# EAGLE design BLE_LCD (EAGLE 9.2.1)
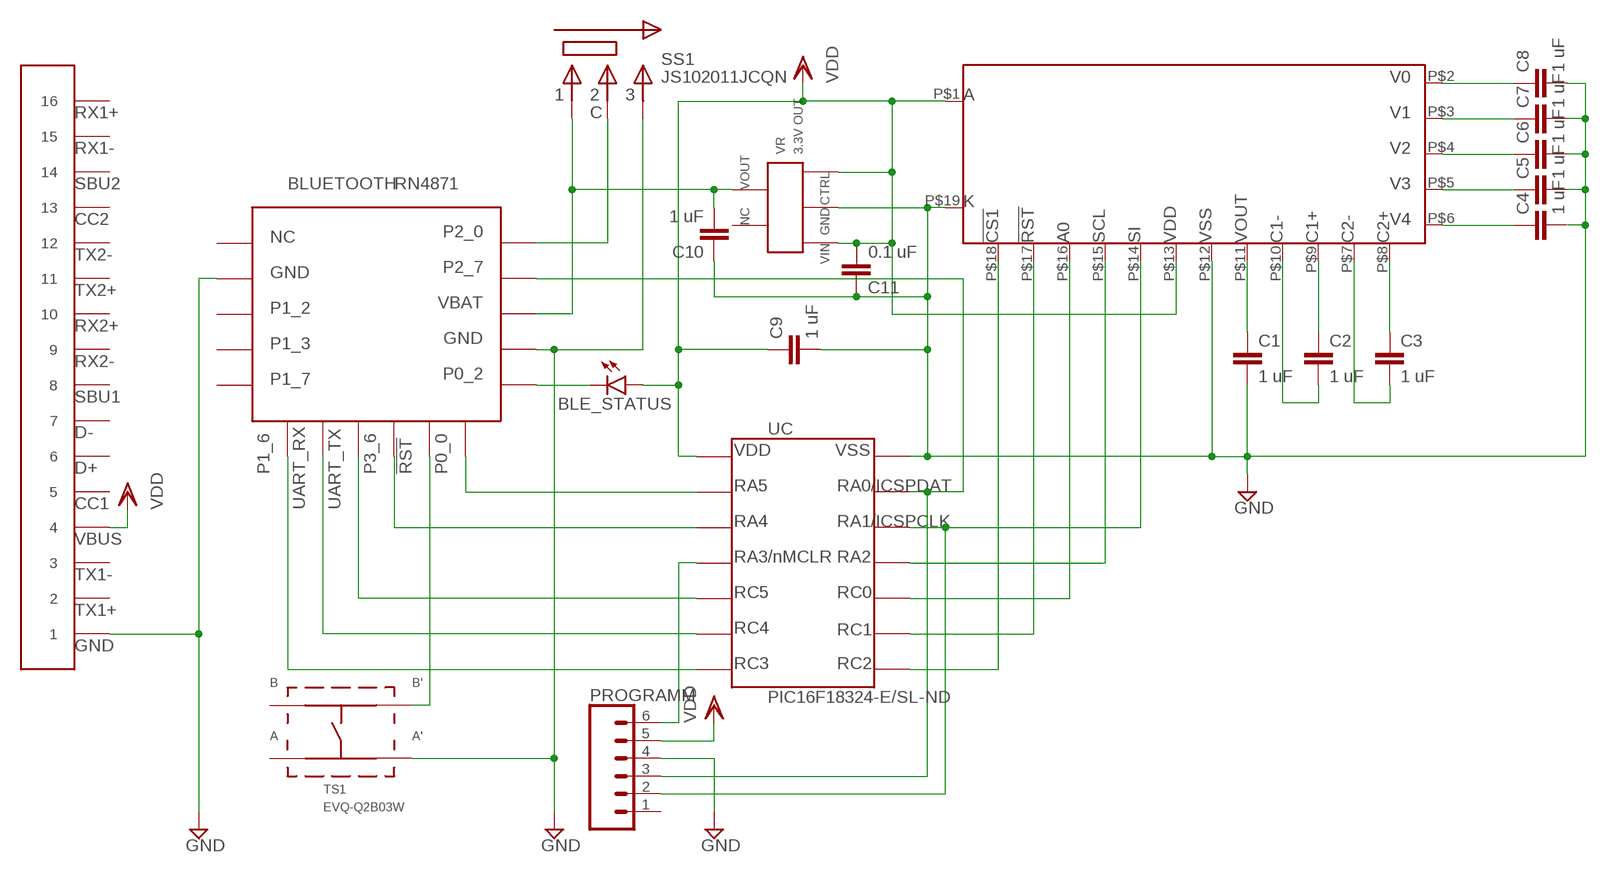
[diagram p0: schematic, sheet 1]

## Parts
5VPOWER  USB-C  [USB-C]
BLE_STATUS  LEDCHIPLED_1206  [CHIPLED_1206]
BLUETOOTH  RN4871  [RN4871]
C1  1 uF  C-EUC0805  [C0805]
C2  1 uF  C-EUC0805  [C0805]
C3  1 uF  C-EUC0805  [C0805]
C4  1 uF  C-EUC0805  [C0805]
C5  1 uF  C-EUC0805  [C0805]
C6  1 uF  C-EUC0805  [C0805]
C7  1 uF  C-EUC0805  [C0805]
C8  1 uF  C-EUC0805  [C0805]
C9  1 uF  C-EUC0805  [C0805]
C10  1 uF  C-EUC0805  [C0805]
C11  0.1 uF  C-EUC0805  [C0805]
LCD  NHD-C12832A1Z-NSW-BBW-3V3  [NHD-C12832A1Z-NSW-BBW-3V3]
PROGRAMM  CONN_06NO_SILK_FEMALE_PTH  [1X06_NO_SILK]
SS1  JS102011JCQN  [JS102011JCQN]
TS1  EVQ-Q2B03W  [EVQ-Q2B03W]
UC  PIC16F18324-E/SL-ND  [PIC16F18324-E/SL-ND]
VR  3.3V OUT  TCR2EF33LM  [TCR2EF33LM]

## Nets
GND: 5VPOWER.A1 5VPOWER.A12 5VPOWER.B1 5VPOWER.B12 BLUETOOTH.P$2 BLUETOOTH.P$13 C1.2 C4.2 C5.2 C6.2 C7.2 C8.2 C9.2 C10.1 C11.1 LCD.P$12 LCD.P$19 PROGRAMM.4 SS1.P$3 TS1.P$4 UC.P$14 VR.P$2
N$1: C4.1 LCD.P$6
N$2: C5.1 LCD.P$5
N$3: C6.1 LCD.P$4
N$4: C7.1 LCD.P$3
N$5: C8.1 LCD.P$2
N$6: C1.1 LCD.P$11
N$7: C2.1 LCD.P$9
N$8: C2.2 LCD.P$10
N$9: C3.1 LCD.P$8
N$10: C3.2 LCD.P$7
N$11: LCD.P$15 UC.P$11
N$12: LCD.P$16 UC.P$10
N$13: LCD.P$17 UC.P$9
N$14: LCD.P$18 UC.P$8
N$15: LCD.P$14 PROGRAMM.2 UC.P$12
N$16: BLUETOOTH.P$6 UC.P$7
N$17: BLUETOOTH.P$7 UC.P$6
N$18: PROGRAMM.6 UC.P$4
N$19: BLUETOOTH.P$14 C10.2 SS1.P$1 VR.P$5
N$20: BLUETOOTH.P$10 TS1.P$3
N$21: BLUETOOTH.P$8 UC.P$5
N$22: BLUETOOTH.P$9 UC.P$3
N$23: BLUETOOTH.P$11 UC.P$2
N$24: BLE_STATUS.C BLUETOOTH.P$12
N$25: BLUETOOTH.P$15 PROGRAMM.3 UC.P$13
N$26: BLUETOOTH.P$16 SS1.P$2
VDD: 5VPOWER.A4 5VPOWER.A9 5VPOWER.B4 5VPOWER.B9 BLE_STATUS.A C9.1 C11.2 LCD.P$1 LCD.P$13 PROGRAMM.5 UC.P$1 VR.P$1 VR.P$3
Unconnected: 5VPOWER.A2 5VPOWER.A3 5VPOWER.A5 5VPOWER.A6 5VPOWER.A7 5VPOWER.A8 5VPOWER.A10 5VPOWER.A11 5VPOWER.B2 5VPOWER.B3 5VPOWER.B5 5VPOWER.B6 5VPOWER.B7 5VPOWER.B8 5VPOWER.B10 5VPOWER.B11 BLUETOOTH.P$1 BLUETOOTH.P$3 BLUETOOTH.P$4 BLUETOOTH.P$5 PROGRAMM.1 TS1.P$1 TS1.P$2 VR.P$4

## Library data of the parts
5VPOWER = USB:USB-C
BLE_STATUS = led:LED: LED OSRAM: - CHIPLED LG R971, LG N971, LY N971, LG Q971, LY Q971, LO R971, LY R971 LH N974, LH R974 LS Q976, LO Q976, LY Q976 LO Q996 - Hyper CHIPLED LW Q18S LB Q993, LB Q99A, LB R99A - SideLED LS A670, LO A670, LY A670, LG A670, LP A670 LB A673, LV A673, LT A673, LW A673 LH A674 LY A675 LS A676, LA A676, LO A676, LY A676, LW A676 LS A679, LY A679, LG A679 - Hyper Micro SIDELED® LS Y876, LA Y876, LO Y876, LY Y876 LT Y87S - SmartLED LW L88C, LW L88S LB L89C, LB L89S, LG L890 LS L89K, LO L89K, LY L89K LS L896, LA L896, LO L896, LY L896 - TOPLED LS T670, LO T670, LY T670, LG T670, LP T670 LSG T670, LSP T670, LSY T670, LOP T670, LYG T670 LG T671, LOG T671, LSG T671 LB T673, LV T673, LT T673, LW T673 LH T674 LS T676, LA T676, LO T676, LY T676, LB T676, LH T676, LSB T676, LW T676 LB T67C, LV T67C, LT T67C, LS T67K, LO T67K, LY T67K, LW E67C LS E67B, LA E67B, LO E67B, LY E67B, LB E67C, LV E67C, LT E67C LW T67C LS T679, LY T679, LG T679 LS T770, LO T770, LY T770, LG T770, LP T770 LB T773, LV T773, LT T773, LW T773 LH T774 LS E675, LA E675, LY E675, LS T675 LS T776, LA T776, LO T776, LY T776, LB T776 LHGB T686 LT T68C, LB T68C - Hyper Mini TOPLED® LB M676 - Mini TOPLED Santana® LG M470 LS M47K, LO M47K, LY M47K Source: http://www.osram.convergy.de LUXEON: - LUMILED® LXK2-PW12-R00, LXK2-PW12-S00, LXK2-PW14-U00, LXK2-PW14-V00 LXK2-PM12-R00, LXK2-PM12-S00, LXK2-PM14-U00 LXK2-PE12-Q00, LXK2-PE12-R00, LXK2-PE12-S00, LXK2-PE14-T00, LXK2-PE14-U00 LXK2-PB12-K00, LXK2-PB12-L00, LXK2-PB12-M00, LXK2-PB14-N00, LXK2-PB14-P00, LXK2-PB14-Q00 LXK2-PR12-L00, LXK2-PR12-M00, LXK2-PR14-Q00, LXK2-PR14-R00 LXK2-PD12-Q00, LXK2-PD12-R00, LXK2-PD12-S00 LXK2-PH12-R00, LXK2-PH12-S00 LXK2-PL12-P00, LXK2-PL12-Q00, LXK2-PL12-R00 Source: www.luxeon.com KINGBRIGHT: KA-3528ASYC Source: www.kingbright.com
BLUETOOTH = Microchip_BLE:RN4871
C1-C11 = rcl:C-EU: CAPACITOR, European symbol; SPICEPREFIX: C
LCD = Newhaven_display:NHD-C12832A1Z-NSW-BBW-3V3
PROGRAMM = SparkFun-Connectors:CONN_06: Multi connection point. Often used as Generic Header-pin footprint for 0.1 inch spaced/style header connections On any of the 0.1 inch spaced packages, you can populate with these: Break Away Headers - Straight <https://www.sparkfun.com/products/116> (PRT-00116) Break Away Male Headers - Right Angle <https://www.sparkfun.com/products/553> (PRT-00553) Female Headers <https://www.sparkfun.com/products/115> (PRT-00115) Break Away Headers - Machine Pin <https://www.sparkfun.com/products/117> (PRT-00117) Break Away Female Headers - Swiss Machine Pin <https://www.sparkfun.com/products/743> (PRT-00743) Arduino Stackable Header - 6 Pin <https://www.sparkfun.com/products/9280> (PRT-09280) For SCREWTERMINALS and SPRING TERMINALS visit here: Screw Terimnals on SparkFun.com <https://www.sparkfun.com/search/results?term=Screw+Terminals> (5mm/3.5mm/2.54mm spacing) This device is also useful as a general connection point to wire up your design to another part of your project. Our various solder wires solder well into these plated through hole pads. Hook-Up Wire - Assortment (Stranded, 22 AWG) <https://www.sparkfun.com/products/11375> (PRT-11375) Hook-Up Wire - Assortment (Solid Core, 22 AWG) <https://www.sparkfun.com/products/11367> (PRT-11367) View the entire wire category on our website here <https://www.sparkfun.com/categories/141>; PROD_ID: CONN-08437
SS1 = C&K_slide_switch:JS102011JCQN
TS1 = Panasonic_tactile_switch:EVQ-Q2B03W
UC = Microchip_PIC:PIC16F18324-E/SL-ND
VR = Toshiba_voltage_regulator:TCR2EF33LM

## Board
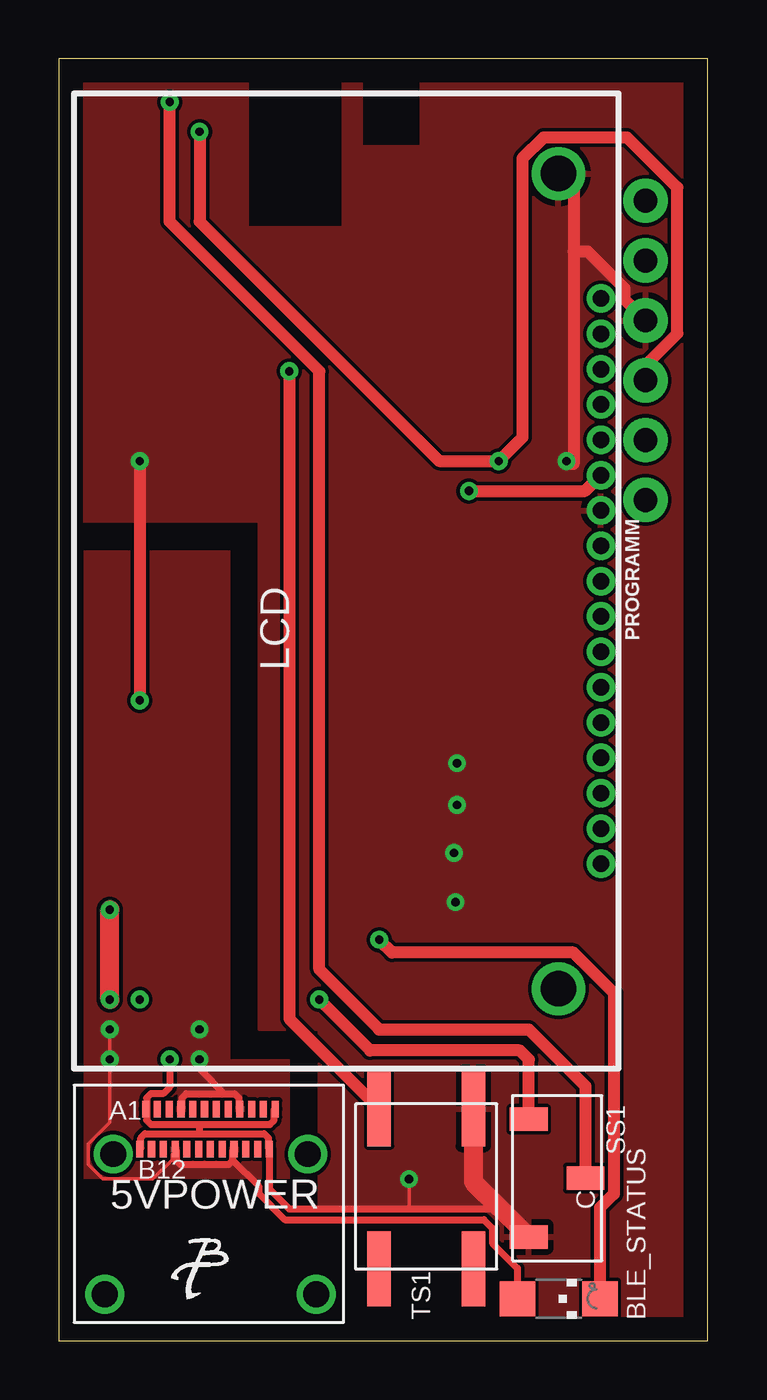
[diagram p1: board, top side]
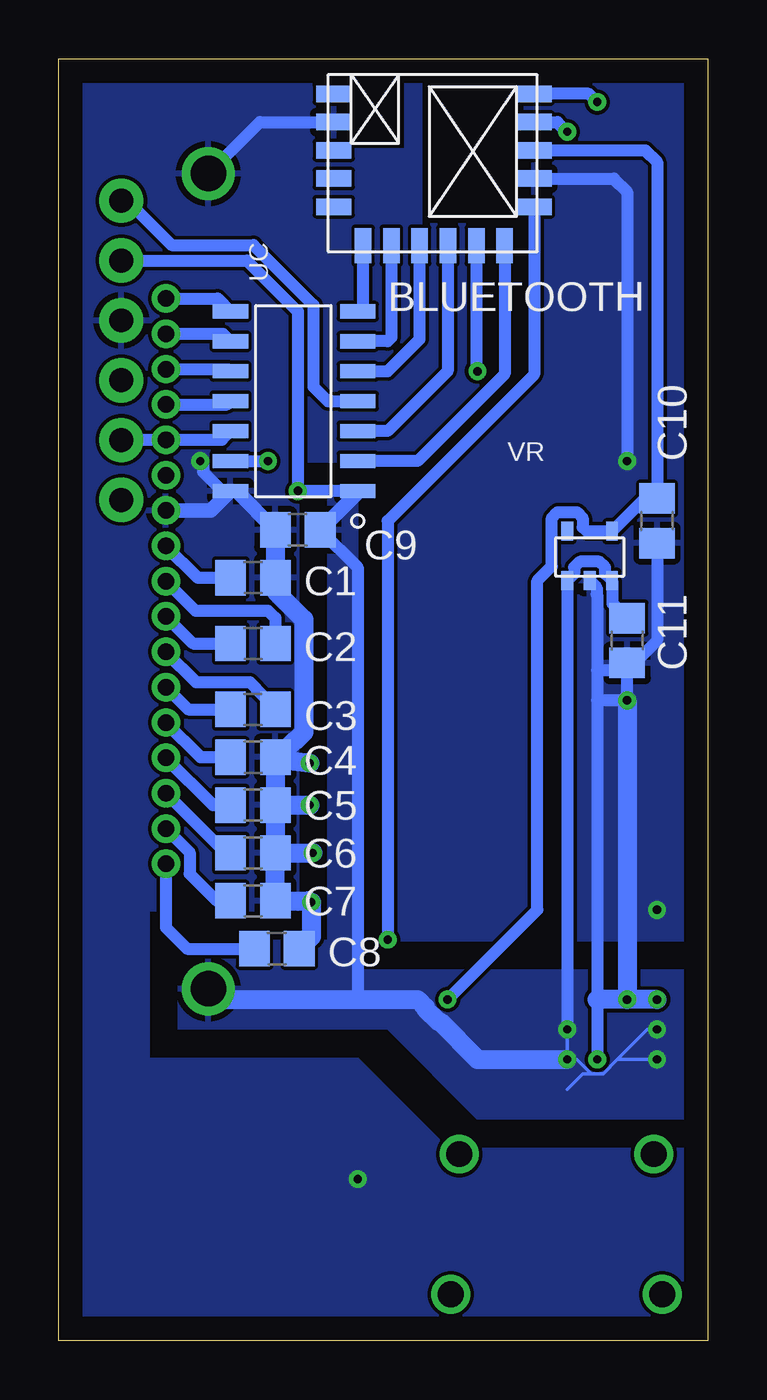
[diagram p2: board, bottom side, seen from below]

Size 27.54 x 54.41 mm. Coordinates in mm from the lower left corner, seen from the top.
Outline: 0,0 27.54,0 27.54,54.41 0,54.41 0,0
Copper layers (1*16): Top 0.035mm / dielectric 1.5mm / Bottom 0.035mm
Design rules "default": minimum track width 6mil, minimum drill 0.35mm, track to track 6mil, track to pad 6mil, pad to pad 6mil, via to via 6mil, smd to smd 6mil, copper to edge 40mil, drill to drill 6mil, minimum pad ring 10mil, minimum via ring 8mil, stop-mask expansion 4mil, vias tented up to drill 0mil, thermal gap 10mil

### Footprints (pad centres in the part's own frame; a part is rotated, then mirrored left to right if it is on the bottom)
USB-C = drill 1.1: 1 -1.13,-0.21; 2 7.13,-0.21; 3 -1.49,-6.16; 4 7.49,-6.16 | smd 0.3 x 0.7: A1 0.25,1.7; A2 0.75,1.7; A3 1.25,1.7; A4 1.75,1.7; A5 2.25,1.7; A6 2.75,1.7; A7 3.25,1.7; A8 3.75,1.7; A9 4.25,1.7; A10 4.75,1.7; A11 5.25,1.7; A12 5.75,1.7; B1 5.5,0; B2 5,0; B3 4.5,0; B4 4,0; B5 3.5,0; B6 3,0; B7 2.5,0; B8 2,0; B9 1.5,0; B10 1,0; B11 0.5,0; B12 0,0
CHIPLED_1206 = smd 1.5 x 1.5: A 0,-1.75; C 0,1.75
RN4871 = smd 1.5 x 0.7: P$1 0.25,6.7; P$2 0.25,5.5; P$3 0.25,4.3; P$4 0.25,3.1; P$5 0.25,1.9; P$12 8.75,1.9; P$13 8.75,3.1; P$14 8.75,4.3; P$15 8.75,5.5; P$16 8.75,6.7 | smd 0.7 x 1.5: P$6 1.5,0.25; P$7 2.7,0.25; P$8 3.9,0.25; P$9 5.1,0.25; P$10 6.3,0.25; P$11 7.5,0.25
C0805 = smd 1.3 x 1.5: 1 -0.95,0; 2 0.95,0
NHD-C12832A1Z-NSW-BBW-3V3 = drill 1.5: P$1 3,2.55; P$19 37.6,2.55 | drill 0.7: P$2 8.3,0.75; P$3 9.8,0.75; P$4 11.3,0.75; P$5 12.8,0.75; P$6 14.3,0.75; P$7 15.8,0.75; P$8 17.3,0.75; P$9 18.8,0.75; P$10 20.3,0.75; P$11 21.8,0.75; P$12 23.3,0.75; P$13 24.8,0.75; P$14 26.3,0.75; P$15 27.8,0.75; P$16 29.3,0.75; P$17 30.8,0.75; P$18 32.3,0.75
1X06_NO_SILK = drill 1.016 pad 1.88: 1 0,0; 2 2.54,0; 3 5.08,0; 4 7.62,0; 5 10.16,0; 6 12.7,0
JS102011JCQN = smd 1 x 1.6: P$1 0,0; P$2 2.5,2.4; P$3 5,0
EVQ-Q2B03W = smd 3.2 x 1: P$1 0,0; P$2 0,-4; P$3 6.8,0; P$4 6.8,-4
PIC16F18324-E/SL-ND = smd 0.6 x 1.5: P$1 0,0; P$2 1.27,0; P$3 2.54,0; P$4 3.81,0; P$5 5.08,0; P$6 6.35,0; P$7 7.62,0; P$8 7.62,5.4; P$9 6.35,5.4; P$10 5.08,5.4; P$11 3.81,5.4; P$12 2.54,5.4; P$13 1.27,5.4; P$14 0,5.4
TCR2EF33LM = smd 0.5 x 0.8: P$1 0,0; P$2 0.95,0; P$3 1.9,0; P$4 0,2.1; P$5 1.9,2.1

### Placement (x,y rotation side)
5VPOWER  3.43,8.13 0 top
BLE_STATUS  21.21,1.78 270 top
BLUETOOTH  16.13,46.23 0 bottom
C1  19.3,32.38 0 bottom
C2  19.3,29.59 0 bottom
C3  19.3,26.8 180 bottom
C4  19.3,24.77 0 bottom
C5  19.3,22.73 0 bottom
C6  19.3,20.7 0 bottom
C7  19.3,18.67 0 bottom
C8  18.29,16.64 0 bottom
C9  17.4,34.42 180 bottom
C10  2.16,34.8 90 bottom
C11  3.43,29.72 90 bottom
LCD  23.75,11.94 90 top
PROGRAMM  24.89,35.69 90 top
SS1  19.94,9.4 270 top
TS1  13.59,3.05 90 top
UC  14.86,36.07 90 bottom
VR  5.97,32.26 0 bottom

### Tracks (layer width: path | path; a pad name or v marks a point on that pad's centre or on a via)
GND  (via drill 0.35)
  Top 0.152: 14.86,5.59 v14.86,6.86
  Top 0.305: 5.97,8.78 3.65,8.78 3.47,8.6 3.47,8.17 5VPOWER.B12 | 5.97,8.78 8.71,8.78 8.88,8.6 8.88,8.17 5VPOWER.B1 8.93,6.44 9.78,5.59 14.86,5.59 18.67,5.59 18.71,5.63 | 5VPOWER.A1 3.72,9.78 | 3.72,9.78 3.72,9.35 3.9,9.17 5.97,9.17 | 5VPOWER.A12 9.13,9.78 9.13,9.35 8.96,9.17 5.97,9.17 | 5.97,8.78 5.97,9.17 | v4.7,11.94 4.7,10.76 4.42,10.48 3.9,10.48 3.72,10.3 3.72,9.78
  Top 0.508: LCD.P$19 21.84,48.89 21.84,46.23 | 21.84,46.23 21.84,37.21 21.67,37.21 v21.54,37.34 | v3.43,37.34 v3.43,27.18 | PROGRAMM.4 24.01,44.19 24.01,44.66 22.44,46.23 21.84,46.23
  Top 0.813: TS1.P$4 17.59,6.75 18.71,5.63 SS1.P$3 | v2.16,14.48 v2.16,18.29
  Bottom 0.508: LCD.P$19 19.01,51.73 BLUETOOTH.P$2 | VR.P$2 4.72,31.96 4.72,31.69 4.7,31.66 4.7,28.45 | 4.7,28.45 4.7,27.18 | 4.7,27.18 4.7,14.48 v4.7,11.94 | v21.54,37.34 21.41,37.21 21.41,36.87 20.61,36.07 UC.P$14 | C11.1 3.75,28.45 4.7,28.45 | C10.1 2.16,29.72 3.11,28.77 C11.1 | BLUETOOTH.P$13 3.99,49.33 3.43,48.77 v3.43,37.34 | 4.7,27.18 v3.43,27.18 C11.1
  Bottom 0.61: C9.2 20,36.07 UC.P$14 21.09,35.24 LCD.P$12
  Bottom 0.813: C9.2 C1.2 18.35,31.82 17.14,30.61 17.14,25.82 17.47,25.49 17.5,25.49 18.35,24.64 | 18.35,24.64 C4.2 18.29,24.7 v16.89,24.51 | 18.35,24.64 C5.2 | C5.2 C6.2 | C6.2 C7.2 16.97,18.67 v16.83,18.61 16.83,17.14 C8.2 | v2.16,14.48 v3.43,14.48 | v3.43,14.48 4.7,14.48 | C6.2 v16.76,20.7 | C5.2 v16.89,22.73 | v3.43,27.18 v3.43,14.48
  pour Bottom: 0.89,8.13 11.05,8.13 14.86,11.94 23.75,11.94 23.75,17.02 23.75,18.29 17.4,18.29 17.4,37.34 13.59,37.34 13.59,17.02 -0.38,17.02 -0.38,55.12 7.24,55.12 7.75,55.12 7.75,47.37 12.19,47.37 12.19,55.12 12.83,55.12 12.83,50.55 15.62,50.55 15.62,55.12 27.56,55.12 27.56,-0.76 -0.38,-0.76 -0.38,8.13
  pour Top: -0.38,5.59 11.05,5.59 11.05,13.21 8.51,13.21 8.51,34.8 -0.38,34.8 -0.38,55.12 8,55.12 8,47.24 12.06,47.24 12.06,54.99 12.06,55.12 12.83,55.12 12.83,50.67 15.37,50.67 15.37,55.12 27.56,55.12 27.56,-0.76 -0.38,-0.76
N$1
  Bottom 0.508: LCD.P$6 21.53,24.77 C4.1
N$2
  Bottom 0.508: LCD.P$5 20.99,22.73 C5.1
N$3
  Bottom 0.508: LCD.P$4 20.46,20.7 C6.1
N$4
  Bottom 0.508: LCD.P$3 21.99,20.73 21.99,19.82 20.84,18.67 C7.1
N$5
  Bottom 0.508: LCD.P$2 23,17.54 22.1,16.64 C8.1
N$6
  Bottom 0.508: LCD.P$11 21.65,32.38 C1.1
N$7
  Bottom 0.508: LCD.P$9 21.85,29.59 C2.1
N$8
  Bottom 0.508: LCD.P$10 21.75,30.99 18.67,30.99 18.35,30.67 C2.2
N$9
  Bottom 0.508: LCD.P$8 21.71,27.95 19.44,27.95 19.2,27.71 18.35,26.86 C3.1
N$10
  Bottom 0.508: LCD.P$7 22.06,26.8 C3.2
N$11
  Bottom 0.508: LCD.P$15 20.4,39.74 UC.P$11
N$12
  Bottom 0.508: LCD.P$16 20.35,41.24 UC.P$10
N$13
  Bottom 0.508: LCD.P$17 20.58,42.74 UC.P$9
N$14
  Bottom 0.508: LCD.P$18 20.81,44.24 UC.P$8
N$15
  Bottom 0.508: UC.P$12 20.63,38.24 LCD.P$14 PROGRAMM.2
N$16
  Bottom 0.508: UC.P$7 14.63,43.92 BLUETOOTH.P$6
N$17
  Bottom 0.508: BLUETOOTH.P$7 13.43,42.58 13.59,42.42 UC.P$6
N$18
  Bottom 0.508: PROGRAMM.6 24.64,48.39 22.76,46.51 19.28,46.51 16.74,43.96 16.74,40.49 16.13,39.88 UC.P$4
N$19  (via drill 0.35)
  Top 0.508: SS1.P$1 19.94,11.94 19.56,12.32 13.21,12.32 v11.05,14.48
  Bottom 0.508: v11.05,14.48 7.24,18.29 7.24,32.26 6.62,32.87 6.62,34.93 6.39,35.16 5.55,35.16 5.31,34.93 5.31,34.53 5.14,34.36 VR.P$5 2.68,35.75 C10.2 2.16,50.04 2.65,50.53 BLUETOOTH.P$14
N$20  (via drill 0.35)
  Top 0.508: v9.78,41.15 9.78,13.66 TS1.P$3
  Bottom 0.508: BLUETOOTH.P$10 9.83,41.2 v9.78,41.15
N$21
  Bottom 0.508: UC.P$5 13.59,41.15 12.23,42.51 BLUETOOTH.P$8
N$22
  Bottom 0.508: BLUETOOTH.P$9 11.05,46.46 11.05,41.15 13.59,38.61 UC.P$3
N$23
  Bottom 0.508: UC.P$2 12.32,37.34 8.63,41.03 BLUETOOTH.P$11
N$24  (via drill 0.35)
  Top 0.508: BLE_STATUS.C 22.96,5.64 23.54,6.23 23.54,14.76 21.83,16.47 14.14,16.47 v13.59,17.02
  Bottom 0.508: BLUETOOTH.P$12 7.38,41.01 13.59,34.8 v13.59,17.02
N$25  (via drill 0.35)
  Top 0.508: v5.97,51.31 5.97,47.5 16.13,37.34 v18.67,37.34 19.67,38.34 19.67,50.17 20.57,51.07 24.11,51.07 26.24,48.95 26.24,42.75 24.89,41.4 PROGRAMM.3
  Bottom 0.508: UC.P$13 v18.67,37.34 | BLUETOOTH.P$15 6.38,51.73 v5.97,51.31
N$26  (via drill 0.35)
  Top 0.508: SS1.P$2 22.34,10.81 19.94,13.21 13.59,13.21 11.05,15.75 11.05,41.15 4.7,47.5 v4.7,52.58
  Bottom 0.508: v4.7,52.58 5.05,52.93 BLUETOOTH.P$16
VDD  (via drill 0.35)
  Top 0.152: 4.97,8.08 4.81,7.92 4.81,7.68 3.99,6.86 1.86,6.86 1.24,7.48 1.24,8.35 2.16,9.27 v2.16,11.94 v2.16,13.21
  Top 0.305: 7.38,7.65 7.21,7.47 5.15,7.47 4.97,7.65 4.97,8.08 5VPOWER.B9 | 7.38,7.65 7.38,8.08 5VPOWER.B4 | 7.38,7.65 8.47,6.56 8.47,6.25 9.59,5.13 18.04,5.13 18.39,4.77 18.39,4.14 19.46,3.07 BLE_STATUS.A | v5.97,11.94 5.97,11.54 7.02,10.48 | 7.02,10.48 7.46,10.48 7.63,10.3 7.63,9.87 5VPOWER.A9 | 5VPOWER.A4 5.22,9.87 5.22,10.3 5.4,10.48 7.02,10.48
  Top 0.508: v17.4,36.07 22.33,36.07 LCD.P$13
  Bottom 0.152: 3.84,11.94 v2.16,11.94 | 4.95,11.33 5.56,11.94 v5.97,11.94 v5.97,13.21 | 3.84,11.94 4.45,11.33 4.95,11.33 | v2.16,13.21 2.57,13.21 3.84,11.94 | 4.95,11.33 5.31,11.33 5.97,10.67
  Bottom 0.508: v5.97,13.21 VR.P$1 5.67,32.55 5.67,32.83 5.44,33.06 4.6,33.06 4.36,32.83 4.36,32.55 VR.P$3 4.07,32.24 4.04,32.21 4.04,31.28 C11.2 | C9.1 14.86,32.83 14.86,14.48 | UC.P$1 v17.4,36.07 17.4,43.69 19.56,45.85 PROGRAMM.5
  Bottom 0.61: C9.1 14.86,36.01 UC.P$1
  Bottom 0.813: LCD.P$1 20.74,14.48 14.86,14.48 12.32,14.48 11.99,14.14 11.99,14.09 11.44,13.54 11.38,13.54 9.78,11.94 v5.97,11.94
  pour Top: 9.78,6.86 0.89,6.86 0.89,33.53 7.24,33.53 7.24,11.94 9.78,11.94
  pour Bottom: 22.48,13.21 22.48,15.75 22.48,17.02 16.13,17.02 16.13,33.53 16.13,36.07 14.86,36.07 14.86,15.75 0.89,15.75 0.89,9.4 9.78,9.4 13.59,13.21